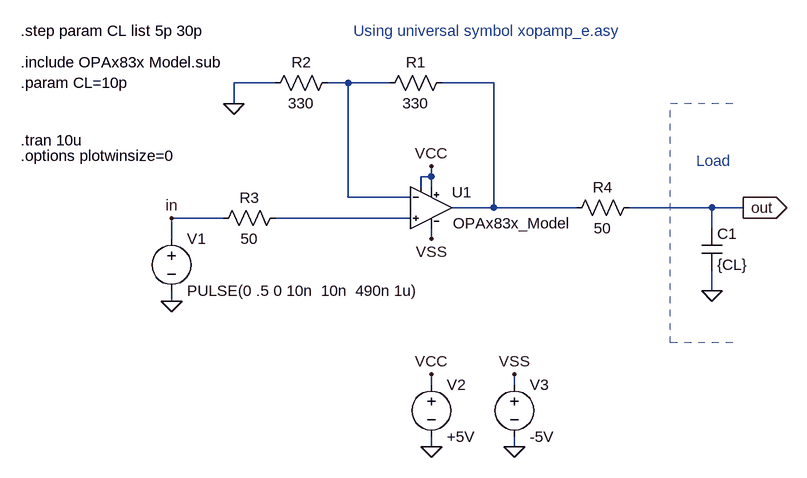
[diagram p0: schematic OPA830_test1.asc]
OPA830_test1.asc, the LTspice schematic file:
Version 4
SHEET 1 880 680
WIRE -128 -48 -192 -48
WIRE -16 -48 -48 -48
WIRE 48 -48 -16 -48
WIRE 208 -48 128 -48
WIRE -192 -16 -192 -48
WIRE 112 96 112 80
WIRE 112 96 96 96
WIRE 96 112 96 96
WIRE 112 112 112 96
WIRE -16 128 -16 -48
WIRE 80 128 -16 128
WIRE 208 144 208 -48
WIRE 208 144 144 144
WIRE 336 144 208 144
WIRE 544 144 416 144
WIRE 592 144 544 144
WIRE -208 160 -288 160
WIRE 80 160 -128 160
WIRE 544 176 544 144
WIRE -288 192 -288 160
WIRE 112 192 112 176
WIRE 544 272 544 240
WIRE -288 288 -288 272
WIRE 112 416 112 400
WIRE 240 416 240 400
WIRE 112 512 112 496
WIRE 240 512 240 496
FLAG 112 80 VCC
FLAG 112 192 VSS
FLAG -288 288 0
FLAG 112 512 0
FLAG 240 512 0
FLAG 112 400 VCC
FLAG 240 400 VSS
FLAG -192 -16 0
FLAG 592 144 out
IOPIN 592 144 Out
FLAG -288 160 in
FLAG 544 272 0
SYMBOL voltage -288 176 R0
WINDOW 123 0 0 Left 0
WINDOW 39 0 0 Left 0
SYMATTR InstName V1
SYMATTR Value PULSE(0 .5 0 10n  10n  490n 1u)
SYMBOL voltage 112 400 R0
SYMATTR InstName V2
SYMATTR Value +5V
SYMBOL voltage 240 400 R0
SYMATTR InstName V3
SYMATTR Value -5V
SYMBOL res 32 -32 R270
WINDOW 0 32 56 VTop 0
WINDOW 3 0 56 VBottom 0
SYMATTR InstName R1
SYMATTR Value 330
SYMBOL res -144 -32 R270
WINDOW 0 32 56 VTop 0
WINDOW 3 0 56 VBottom 0
SYMATTR InstName R2
SYMATTR Value 330
SYMBOL res -224 176 R270
WINDOW 0 32 56 VTop 0
WINDOW 3 0 56 VBottom 0
SYMATTR InstName R3
SYMATTR Value 50
SYMBOL res 320 160 R270
WINDOW 0 32 56 VTop 0
WINDOW 3 0 56 VBottom 0
SYMATTR InstName R4
SYMATTR Value 50
SYMBOL cap 528 176 R0
SYMATTR InstName C1
SYMATTR Value {CL}
SYMBOL xopamp_e 112 80 R0
SYMATTR InstName U1
SYMATTR Value OPAx83x_Model
TEXT -520 40 Left 0 !.tran 10u
TEXT -520 -80 Left 0 !.include OPAx83x Model.sub
TEXT -520 64 Left 0 !.options plotwinsize=0
TEXT -520 -48 Left 0 !.param CL=10p
TEXT -8 -128 Left 0 ;Using universal symbol xopamp_e.asy
TEXT 520 72 Left 0 ;Load
TEXT -520 -128 Left 0 !.step param CL list 5p 30p
LINE Normal 480 352 480 -16 2
LINE Normal 576 352 480 352 2
LINE Normal 576 -16 480 -16 2

The netlist it stands for:
* OPA830_test1.asc
V1 in 0 PULSE(0 .5 0 10n  10n  490n 1u)
V2 VCC 0 +5V
V3 VSS 0 -5V
R1 N001 N002 330
R2 0 N001 330
R3 in N003 50
R4 N002 out 50
C1 out 0 {CL}
XU1 N003 N001 VCC N002 VCC VSS OPAx83x_Model  ; pins In+ In- DIS OUT V+ V-
.tran 10u
.include OPAx83x Model.sub
.options plotwinsize=0
.param CL=10p
* Using universal symbol xopamp_e.asy
* Load
.step param CL list 5p 30p
.backanno
.end